# Altium schematic sheet RealTime.SchDoc
size A4; SheetNumber: 5; SheetTotal: 7
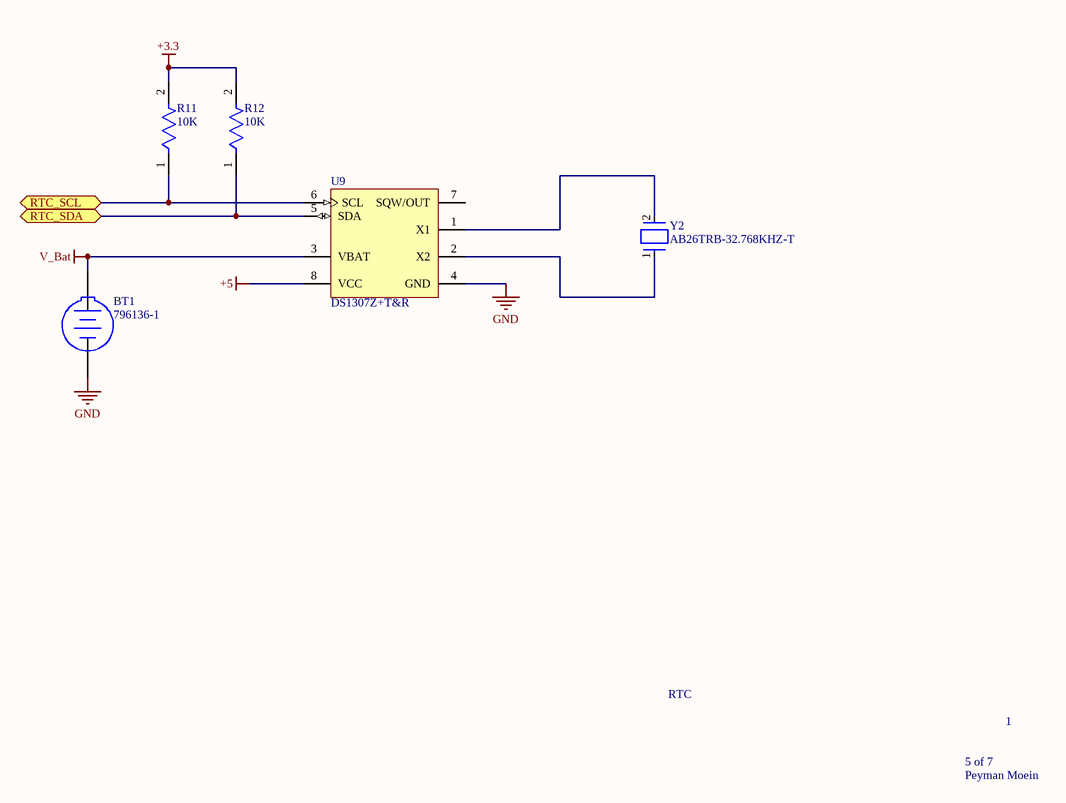
[diagram p0: RealTime.SchDoc]

## Parts
BT1  796136-1  [TECO-796136-1_V]
R11  10K  [FP-CRCW0805-e3-MFG]
R12  10K  [FP-CRCW0805-e3-MFG]
U9  DS1307Z+T&R  [S8+2_L]
Y2  AB26TRB-32.768KHZ-T  [FP-AB26TRB-MFG]

## Ports
RTC_SCL (bidir), RTC_SDA (bidir)

## Nets
+3.3: R11.2 R12.2
+5: U9.8(VCC)
GND: BT1.2(-) U9.4(GND)
V_Bat: BT1.1(+) U9.3(VBAT)
RTC_SCL: R11.1 U9.6(SCL) ; port RTC_SCL
RTC_SDA: R12.1 U9.5(SDA) ; port RTC_SDA
NetU9_1: U9.1(X1) Y2.2
NetU9_2: U9.2(X2) Y2.1

Not connected (* = marked no-connect by the designer): U9 7(SQW/OUT)

## Notes on the sheet
- RTC
- 5 of 7
- 1
- Peyman Moein

## Library data of the parts
BT1 = CMP-1684-00006-2: C70377; Case\Package: 0603; Lens Style: Diffused; Illumination Colour: Blue; Nominal Vf: 3.3 V; Luminous Intensity: 28 mcd; Forward Voltage: 2.8 V; Forward Current: 20 mA; Viewing Angle: 130 degrees; Pins: 2; Package Quantity: 3000; Case Code (Imperial): 0603; Colour: Blue; ComponentLink2Description: Datasheet; Packaging: Tape and Reel; Length: 1.6 mm; Max Operating Temperature: 80 degC; ComponentLink2URL: http://www.te.com/commerce/DocumentDelivery/DDEController?Action=srchrtrv&DocNm=796136&DocType=Customer+Drawing&DocLang=English&DocFormat=pdf&PartCntxt=796136-1; PackageReference: 796136-1; Case Code (Metric): 1608; PackageDescription: 2-Pin Surface Mount Device, Body 32.31 x 19.05 mm; ComponentLink1Description: Manufacturer URL; Mount: Surface Mount; ComponentLink1URL: http://www.te.com/; Min Operating Temperature: -20 degC; Width: 0.8 mm; DatasheetVersion: Dec-13; Radiation Hardening: No; RoHSCompliant: true; Height: 0.8 mm
R11 R12 = CMP-02407-004193-1: C478887; Tolerance: 1%; Resistance: 2.94R; Max Power Dissipation: 125mW; Temperature Coefficient: 100ppm/°C; Voltage Rating: 150V; Case/Package: 0805; Radiation Hardening: No; Width: 0.049inch; Packaging: Tape and Reel; Height: 0.02inch; Case Code (Imperial): 0805; Length: 2mm; Termination: SMD/SMT; Lead Free: Lead Free; Weight: 0.000194oz; Features: Automotive AEC-Q200; Min Operating Temperature: -55°C; Case Code (Metric): 2012; Contact Plating: Tin; Composition: Thick Film; Military Standard: Not; Number of Terminations: 2; Depth: 1.25mm; Package Quantity: 10; Max Operating Temperature: 155°C; Power Rating: 125mW
U9 = CMP-0254-00305-1: C9868; Code_JEDEC: MS-012-AA; Code_IPC: SOIC127P600-8; ComponentLink2Description: Datasheet; DatasheetVersion: 10-Feb-2008; ComponentLink2URL: http://datasheets.maxim-ic.com/en/ds/DS1307.pdf; PackageVersion: revC, 2010; ComponentLink1Description: Manufacturer URL; PackageDescription: 8-Pin Small-Outline IC, Narrow (0.15in), 1.27 mm Pitch, SOIC (N), Pb-Free; ComponentLink1URL: http://www.maxim-ic.com; ComponentLink3URL: http://pdfserv.maxim-ic.com/package_dwgs/21-0041.PDF; PackageReference: S8+2; ComponentLink3Description: Package Specification
Y2 = CMP-27762-006068-1: C179645; Frequency Stability: -0.034ppm; Frequency Tolerance: 20ppm; Load Capacitance: 12.5pF; Series Resistance: 50kR; Case/Package: Radial; Package Quantity: 500; Packaging: Tape and Reel; Lead Pitch: 2.54mm; Termination: Radial; Mount: Surface Mount; Frequency: 32.768kHz; Min Operating Temperature: -40°C; REACH SVHC: No SVHC; Lead Free: Lead Free; Operating Frequency: 32.768 kHz; Max Operating Temperature: 85°C; Length: 6mm; Height: 0.075inch; Depth: 1.9mm; Tolerance: 20ppm; ESR (Equivalent Series Resistance): 50kR; Number of Pins: 2; Series: AB26TRB